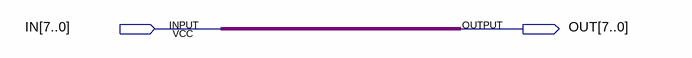
[diagram p0: schematic sheet]
// Quartus schematic MUL1.bdf as structural Verilog: 0 symbols, 2 pins
module MUL1 (
  input  [7:0] IN,
  output [7:0] OUT
);


  assign OUT = IN;
endmodule
